# EAGLE design MAPS_nano (EAGLE 7.2.0)
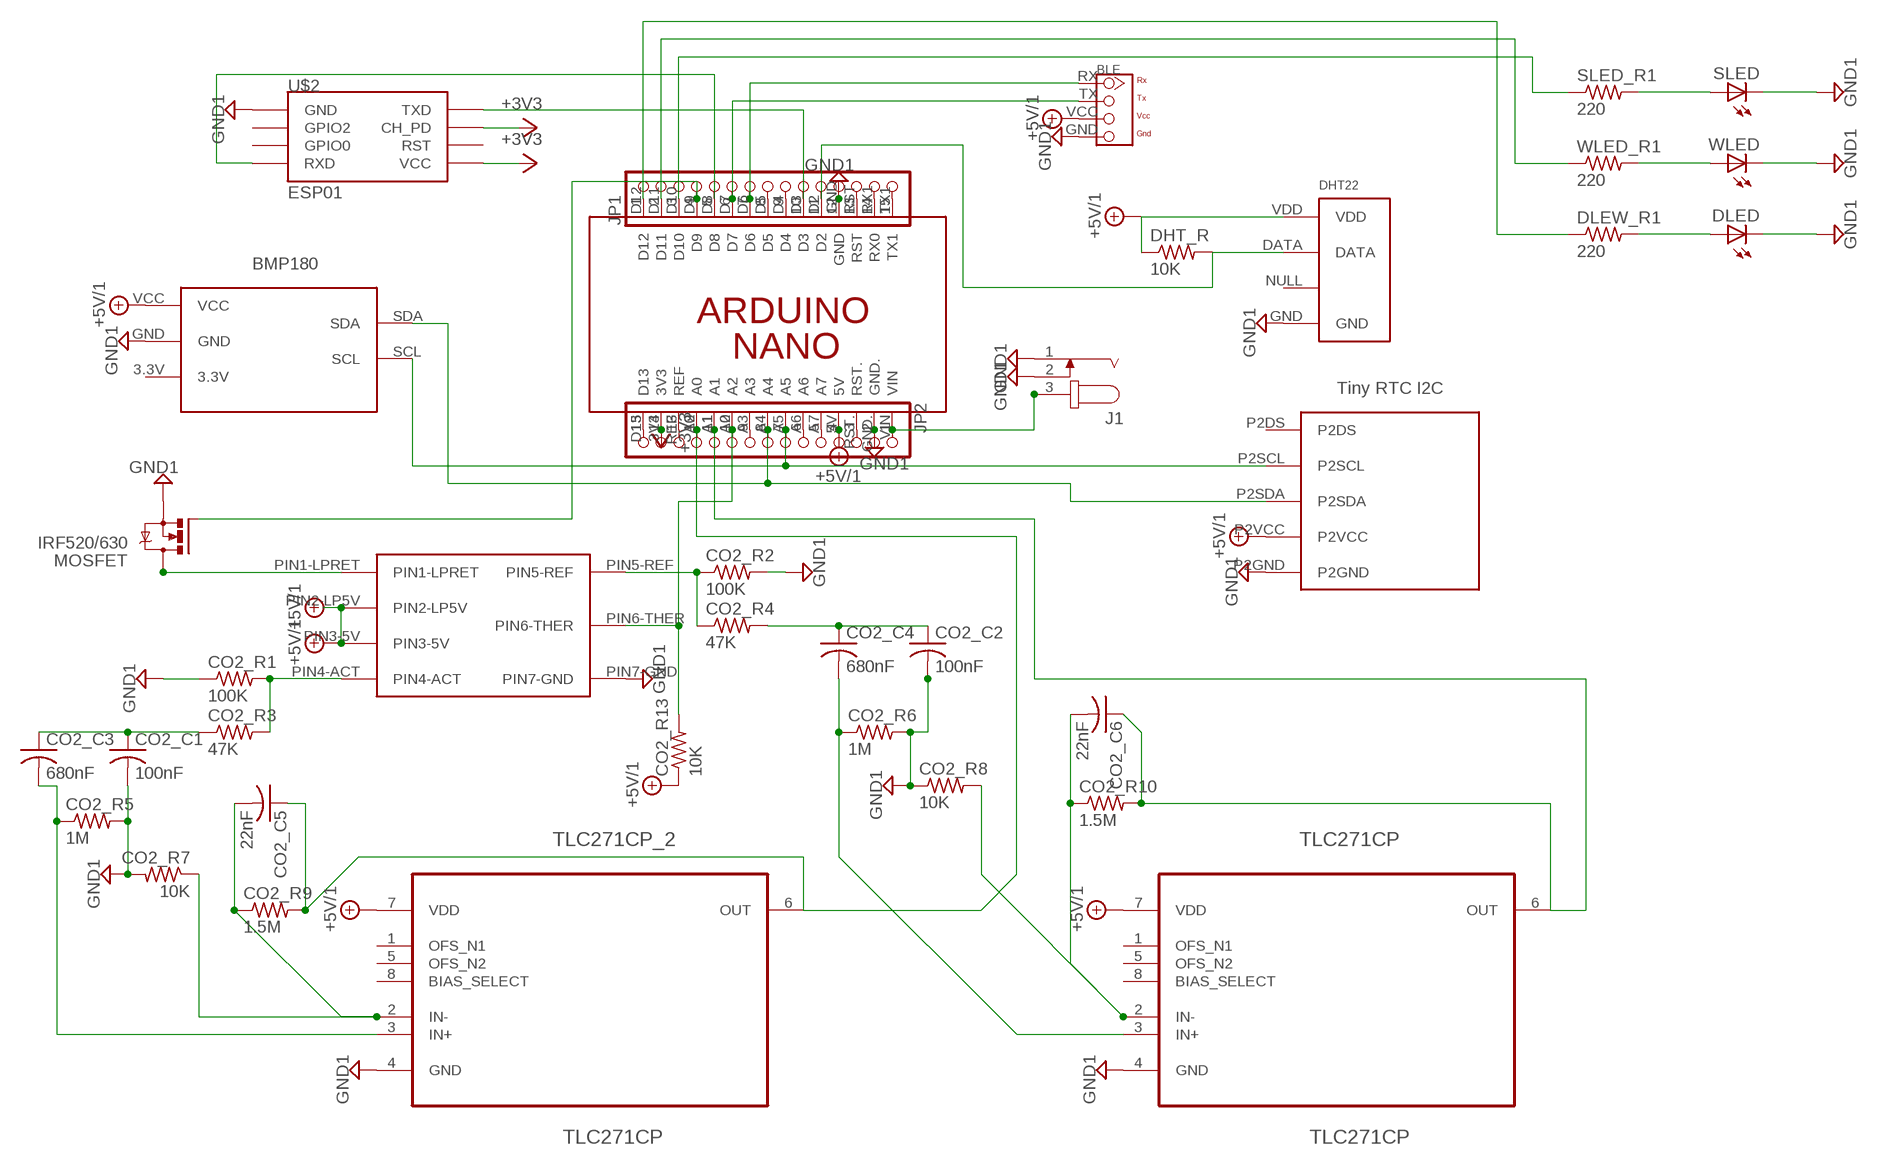
[diagram p0: schematic, sheet 1]

## Parts
BMP180  BMP180  [BMP180]
CO2_C1  100nF  C-USC0805  [C0805]
CO2_C2  100nF  C-USC0805  [C0805]
CO2_C3  680nF  C-USC0805  [C0805]
CO2_C4  680nF  C-USC0805  [C0805]
CO2_C5  22nF  C-USC0805  [C0805]
CO2_C6  22nF  C-USC0805  [C0805]
CO2_R1  100K  R-US_R0805  [R0805]
CO2_R2  100K  R-US_R0805  [R0805]
CO2_R3  47K  R-US_R0805  [R0805]
CO2_R4  47K  R-US_R0805  [R0805]
CO2_R5  1M  R-US_R0805  [R0805]
CO2_R6  1M  R-US_R0805  [R0805]
CO2_R7  10K  R-US_R0805  [R0805]
CO2_R8  10K  R-US_R0805  [R0805]
CO2_R9  1.5M  R-US_R0805  [R0805]
CO2_R10  1.5M  R-US_R0805  [R0805]
CO2_R13  10K  R-US_R0805  [R0805]
DHT_R  10K  R-US_R0805  [R0805]
DLED  LED5MM  [LED5MM]
DLEW_R1  220  R-US_R0805  [R0805]
J1  JACK-PLUG0  [SPC4077]
J2  TWIG-4P-2.0-2.0  [4P-2.0]
JP1  PINHD-1X15-CB  [1X15-CB]
JP2  PINHD-1X15-CB  [1X15-CB]
MOSFET  IRF520/630  IRFZ48Z  [TO220BH]
PCB1  ARDUINO_NANO  [ARDUINO_NANO]
SLED  LED5MM  [LED5MM]
SLED_R1  220  R-US_R0805  [R0805]
TLC271CP  TLC271CP  [DIP254P762X508-8]
TLC271CP_2  TLC271CP  [DIP254P762X508-8]
U1  RHT03_DHT-22_AM2302RA  [RHT03_DHT-22/RA]
U$1  IRC-A1  [ALPHASENSE]
U$2  ESP01  [ESP01]
U$3  RTC_TINY_IIC  [RTC_TINY_IIC]
WLED  LED5MM  [LED5MM]
WLED_R1  220  R-US_R0805  [R0805]

## Nets
+3V3: JP2.14 PCB1.3V3 U$2.CH_PD U$2.VCC
+5V/1: BMP180.VCC CO2_R13.1 DHT_R.1 J2.VCC JP2.4 PCB1.5V TLC271CP.7(VDD) TLC271CP_2.7(VDD) U1.VDD U$1.PIN2-LP5V U$1.PIN3-5V U$3.P2VCC
GND1: BMP180.GND CO2_C1.2 CO2_C2.2 CO2_R1.1 CO2_R2.2 CO2_R5.2 CO2_R6.2 CO2_R7.2 CO2_R8.1 DLED.K(C) J1.1 J1.2 J2.GND JP1.12 JP2.2 MOSFET.S PCB1.GND PCB1.GND. SLED.K(C) TLC271CP.4(GND) TLC271CP_2.4(GND) U1.GND U$1.PIN7-GND U$2.GND U$3.P2GND WLED.K(C)
N$1: DHT_R.2 JP1.11 PCB1.D2 U1.DATA
N$2: J1.3 JP2.1 PCB1.VIN
N$3: JP1.4 MOSFET.G PCB1.D9
N$4: MOSFET.D U$1.PIN1-LPRET
N$5: CO2_R13.2 JP2.10 PCB1.A2 U$1.PIN6-THER
N$6: BMP180.SDA JP2.8 PCB1.A4 U$3.P2SDA
N$7: BMP180.SCL JP2.7 PCB1.A5 U$3.P2SCL
N$8: CO2_C1.1 CO2_C3.1 CO2_R3.1
N$9: CO2_R1.2 CO2_R3.2 U$1.PIN4-ACT
N$10: CO2_C3.2 CO2_R5.1 TLC271CP_2.3(IN+)
N$11: CO2_C5.2 CO2_R7.1 CO2_R9.1 TLC271CP_2.2(IN-)
N$12: CO2_C5.1 CO2_R9.2 JP2.12 PCB1.A0 TLC271CP_2.6(OUT)
N$13: DLEW_R1.1 JP1.1 PCB1.D12
N$14: CO2_R2.1 CO2_R4.1 U$1.PIN5-REF
N$15: CO2_C2.1 CO2_C4.1 CO2_R4.2
N$16: CO2_C4.2 CO2_R6.1 TLC271CP.3(IN+)
N$17: JP1.2 PCB1.D11 WLED_R1.1
N$18: JP1.3 PCB1.D10 SLED_R1.1
N$19: CO2_C6.2 CO2_R8.2 CO2_R10.1 TLC271CP.2(IN-)
N$20: SLED.A SLED_R1.2
N$21: JP1.5 PCB1.D8 U$2.RX(RXD)
N$22: J2.RX JP1.7 PCB1.D6
N$23: J2.TX JP1.6 PCB1.D7
N$24: CO2_C6.1 CO2_R10.2 JP2.11 PCB1.A1 TLC271CP.6(OUT)
N$25: JP1.8 PCB1.D5
N$26: JP1.9 PCB1.D4
N$27: JP1.10 PCB1.D3 U$2.TX(TXD)
N$28: JP1.13 PCB1.RST
N$29: JP1.14 PCB1.RX1(RX0)
N$30: JP1.15 PCB1.TX1
N$31: JP2.3 PCB1.RST.
N$32: JP2.5 PCB1.A7
N$33: JP2.6 PCB1.A6
N$34: JP2.9 PCB1.A3
N$35: JP2.13 PCB1.REF
N$36: JP2.15 PCB1.D13
N$37: WLED.A WLED_R1.2
N$38: DLED.A DLEW_R1.2
Unconnected: BMP180.3.3V TLC271CP.1(OFS_N1) TLC271CP.5(OFS_N2) TLC271CP.8(BIAS_SELECT) TLC271CP_2.1(OFS_N1) TLC271CP_2.5(OFS_N2) TLC271CP_2.8(BIAS_SELECT) U1.NULL U$2.GPIO0 U$2.GPIO2 U$2.RST U$3.P2DS

## Library data of the parts
BMP180 = bmp180:BMP180
CO2_C1-CO2_C6 = resistor:C-US: CAPACITOR, American symbol
CO2_R1-CO2_R10 CO2_R13 DHT_R DLEW_R1 SLED_R1 WLED_R1 = resistor:R-US_: RESISTOR, American symbol
DLED SLED WLED = adafruit:LED: LED OSRAM: - CHIPLED LG R971, LG N971, LY N971, LG Q971, LY Q971, LO R971, LY R971 LH N974, LH R974 LS Q976, LO Q976, LY Q976 LO Q996 - Hyper CHIPLED LW Q18S LB Q993, LB Q99A, LB R99A - SideLED LS A670, LO A670, LY A670, LG A670, LP A670 LB A673, LV A673, LT A673, LW A673 LH A674 LY A675 LS A676, LA A676, LO A676, LY A676, LW A676 LS A679, LY A679, LG A679 - Hyper Micro SIDELED® LS Y876, LA Y876, LO Y876, LY Y876 LT Y87S - SmartLED LW L88C, LW L88S LB L89C, LB L89S, LG L890 LS L89K, LO L89K, LY L89K LS L896, LA L896, LO L896, LY L896 - TOPLED LS T670, LO T670, LY T670, LG T670, LP T670 LSG T670, LSP T670, LSY T670, LOP T670, LYG T670 LG T671, LOG T671, LSG T671 LB T673, LV T673, LT T673, LW T673 LH T674 LS T676, LA T676, LO T676, LY T676, LB T676, LH T676, LSB T676, LW T676 LB T67C, LV T67C, LT T67C, LS T67K, LO T67K, LY T67K, LW E67C LS E67B, LA E67B, LO E67B, LY E67B, LB E67C, LV E67C, LT E67C LW T67C LS T679, LY T679, LG T679 LS T770, LO T770, LY T770, LG T770, LP T770 LB T773, LV T773, LT T773, LW T773 LH T774 LS E675, LA E675, LY E675, LS T675 LS T776, LA T776, LO T776, LY T776, LB T776 LHGB T686 LT T68C, LB T68C - Hyper Mini TOPLED® LB M676 - Mini TOPLED Santana® LG M470 LS M47K, LO M47K, LY M47K Source: http://www.osram.convergy.de/
J1 = con-jack:JACK-PLUG: DC POWER JACK Power Jack, DC, Right Angle, Through Hole, Rated 5A at 16VDC, PC Terminals Distributor: Farnell (www.Farnell.de) Drawing: 84N1161.pdf / 84N1162.pdf Manufacturer: SPC Technology (www.spctechnology.com) Type: SPC4077 / SPC 4078; OC_FARNELL: unknown; OC_NEWARK: unknown
J2 = Connector:TWIG-4P-2.0
JP1 JP2 = adafruit:PINHD-1X15: PIN HEADER
MOSFET = mytransistor-power:IRFZ48: N Channel HEXFET® Power MOSFET Logic Level Source: http://www.irf.com/product-info/datasheets/data/irfz48z.pdf
PCB1 = uno_pin:ARDUINO_NANO: Device for representing an Arduino Nano board with a footprint in an EAGLE design. Created by Dave Young for Element14. More EAGLE documentation at: http://www.element14.com/community/community/knode/cadsoft_eagle
TLC271CP TLC271CP_2 = tlc271cp:TLC271CP: OPERATIONAL AMPLIFIER; MPN: TLC271CP; OC_FARNELL: 1103011; OC_NEWARK: 35K1199; PACKAGE: PDIP-8; SUPPLIER: Texas Instruments
U1 = RHT03_DHT-22_AM2302:RHT03_DHT-22_AM2302: RHT03 / DHT-22 / AM2302 Packages and symbol for the RHT03 / DHT-22 relative humidity and temperature sensor. Note: The AM2302 is a wired version of the DHT-22 which typically requires less clearance and is thus provided as a separate package.; PROD_ID: SEN-10167
U$1 = iRC-A1:IRC-A1: Alpha sense IRC-A1 infrared CO2 sensor
U$2 = esp8266modules:ESP01: ESP8266 Wifi module 01
U$3 = RTC_TINY_IIC:RTC_TINY_IIC

## Board
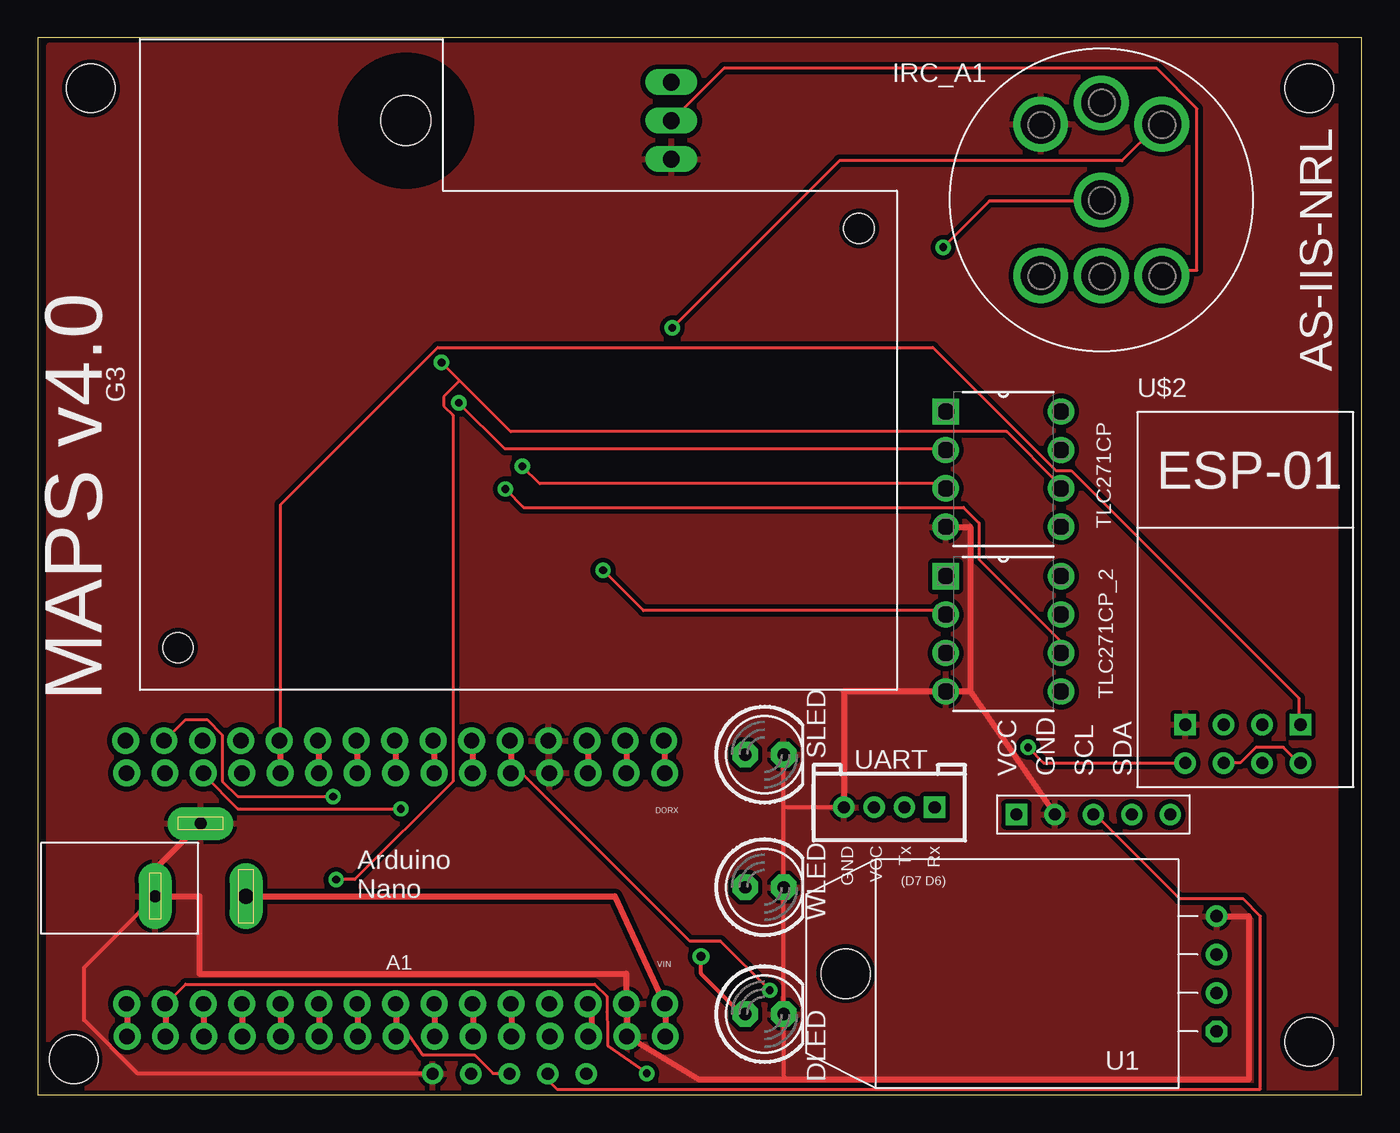
[diagram p1: board, top side]
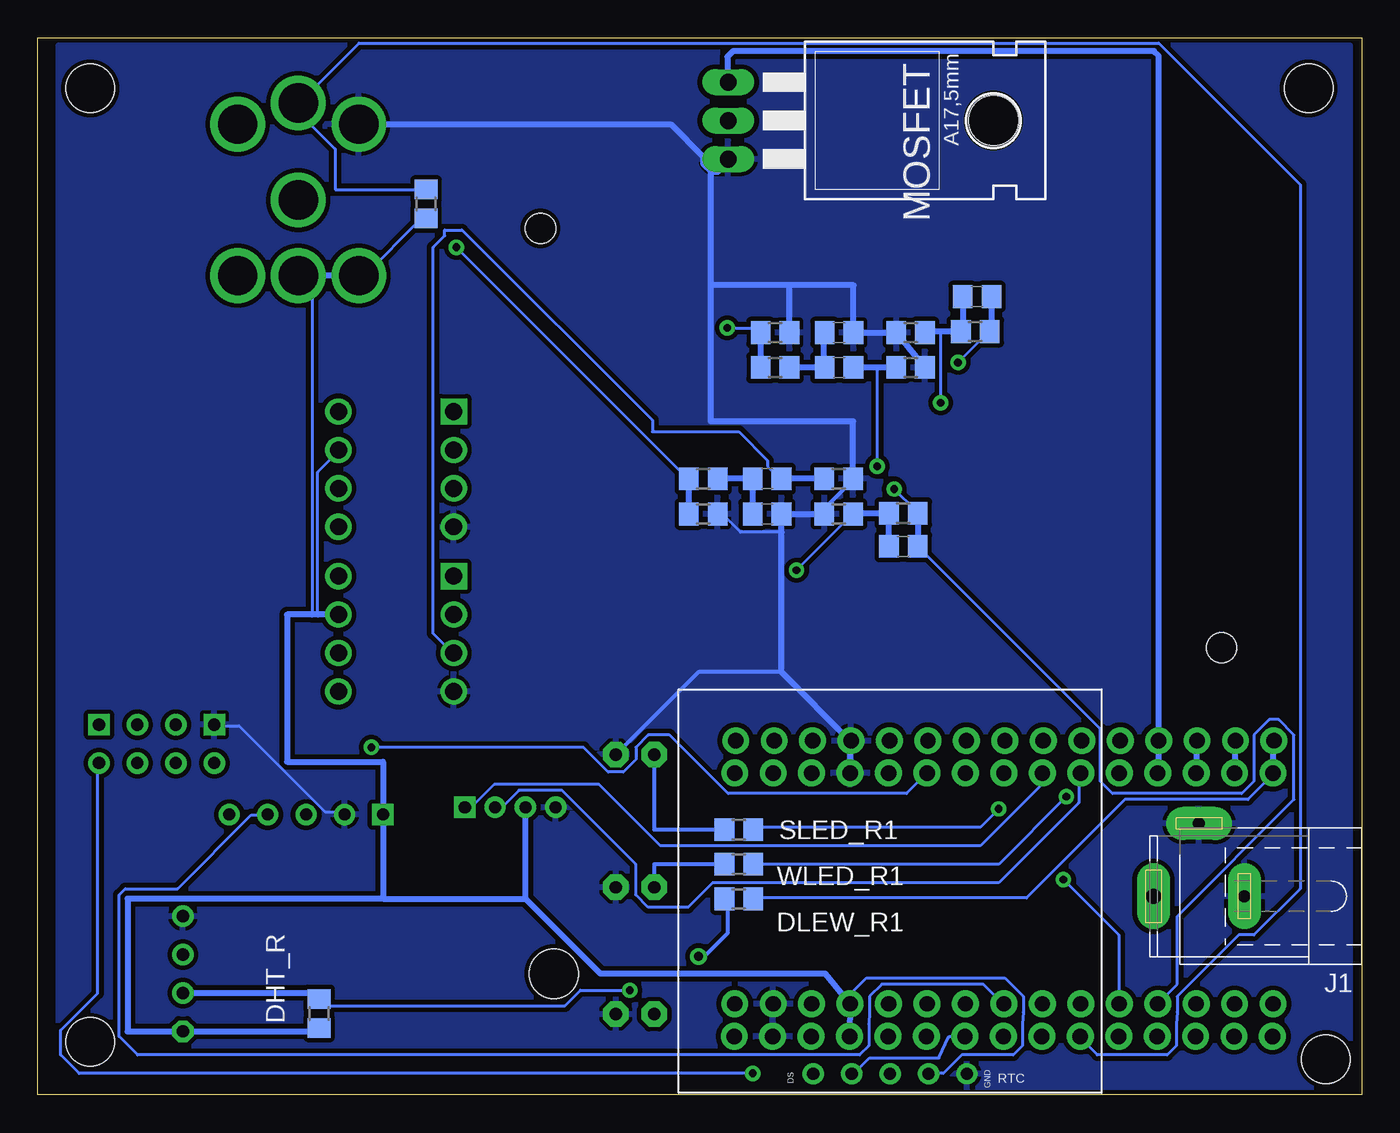
[diagram p2: board, bottom side, seen from below]

Size 87.46 x 69.84 mm. Coordinates in mm from the lower left corner, seen from the top.
Outline: 0,0 87.46,0 87.46,69.84 0,69.84 0,0
Copper layers (1*16): Top 0.035mm / dielectric 1.5mm / Bottom 0.035mm
Design rules "SparkFun": minimum track width 8mil, minimum drill 20mil, track to track 8mil, track to pad 8mil, pad to pad 8mil, via to via 8mil, smd to smd 8mil, copper to edge 8mil, drill to drill 8mil, minimum pad ring 12mil, minimum via ring 10mil, stop-mask expansion 4mil, vias tented up to drill 20mil, thermal gap 10mil
Holes 3.2 mm at 3.5,66.5 84,66.5 2.36,2.36 84,3.5

### Footprints (pad centres in the part's own frame; a part is rotated, then mirrored left to right if it is on the bottom)
BMP180 = drill 0.8: 3.3V -3.81,1.27; GND -11.43,1.27; SCL -8.89,1.27; SDA -6.35,1.27 | drill 0.8 square: VCC -13.97,1.27
C0805 = smd 1.3 x 1.5: 1 -0.95,0; 2 0.95,0
R0805 = smd 1.3 x 1.5: 1 -0.95,0; 2 0.95,0
LED5MM = drill 0.813 pad 1.676 octagon: A -1.27,0; K 1.27,0
SPC4077 = drill 0.8 pad 2.184 long: 1 -3,0; 2 0,-4.8 | drill 1 pad 2.184 long: 3 3,0
4P-2.0 = drill 0.8 pad 1.27: GND 3,0; TX -1,0; VCC 1,0 | drill 0.8 pad 1.27 square: RX -3,0
1X15-CB = drill 1.016 pad 1.778: 1 -17.78,0; 2 -15.24,0; 3 -12.7,0; 4 -10.16,0; 5 -7.62,0; 6 -5.08,0; 7 -2.54,0; 8 0,0; 9 2.54,0; 10 5.08,0; 11 7.62,0; 12 10.16,0; 13 12.7,0; 14 15.24,0; 15 17.78,0
TO220BH = drill 1.118 long: D 0,-6.35; G -2.54,-6.35; S 2.54,-6.35 | hole 3.302: 0,11.176
ARDUINO_NANO = drill 1.016 pad 1.778: 3V3 6.35,1.27; 5V 31.75,1.27; A0 11.43,1.27; A1 13.97,1.27; A2 16.51,1.27; A3 19.05,1.27; A4 21.59,1.27; A5 24.13,1.27; A6 26.67,1.27; A7 29.21,1.27; D2 29.21,16.51; D3 26.67,16.51; D4 24.13,16.51; D5 21.59,16.51; D6 19.05,16.51; D7 16.51,16.51; D8 13.97,16.51; D9 11.43,16.51; D10 8.89,16.51; D11 6.35,16.51; D12 3.81,16.51; D13 3.81,1.27; GND 31.75,16.51; GND. 36.83,1.27; REF 8.89,1.27; RST 34.29,16.51; RST. 34.29,1.27; RX1 36.83,16.51; TX1 39.37,16.51; VIN 39.37,1.27
DIP254P762X508-8 = drill 1.118 square: 1 -7.62,7.62 | drill 1.118: 2 -7.62,5.08; 3 -7.62,2.54; 4 -7.62,0; 5 0,0; 6 0,2.54; 7 0,5.08; 8 0,7.62
RHT03_DHT-22/RA = drill 0.8: DATA -1.27,0; GND 3.81,0; NULL 1.27,0 | drill 0.8 octagon: VDD -3.81,0 | hole 3.25: 0,24.5
ALPHASENSE = drill 2.6: PIN1-LPRET 14,5; PIN2-LP5V 10,5; PIN3-5V 6,5; PIN4-ACT 10,10; PIN5-REF 14,15; PIN6-THER 10,16.4; PIN7-GND 6,15
ESP01 = drill 0.8: CH_PD -1.285,-8.178; GPIO0 1.255,-5.638; GPIO2 -1.285,-5.638; RST 1.255,-8.178; TX -3.825,-8.178; VCC 3.795,-8.178 | drill 0.8 square: GND -3.825,-5.638; RX 3.795,-5.638
RTC_TINY_IIC = drill 0.8: P2DS 1.27,-8.89; P2GND 1.27,-19.05; P2SCL 1.27,-11.43; P2SDA 1.27,-13.97; P2VCC 1.27,-16.51
G3 = hole 2: 30.5,-47.5; 2.8,-2.5

### Placement (x,y rotation side)
BMP180  78.62,17.25 0 top
CO2_C1  39.27,38.38 0 bottom
CO2_C2  34.52,50.37 0 bottom
CO2_C3  39.27,40.71 0 bottom
CO2_C4  34.52,48.06 0 bottom
CO2_C5  30.28,36.24 180 bottom
CO2_C6  25.41,52.74 180 bottom
CO2_R1  43.5,38.38 180 bottom
CO2_R2  38.75,50.37 0 bottom
CO2_R3  43.5,40.71 180 bottom
CO2_R4  38.75,48.06 0 bottom
CO2_R5  34.55,40.71 0 bottom
CO2_R6  29.8,48.06 0 bottom
CO2_R7  34.55,38.38 180 bottom
CO2_R8  29.8,50.37 0 bottom
CO2_R9  30.28,38.42 0 bottom
CO2_R10  25.53,50.43 0 bottom
CO2_R13  61.8,58.87 90 bottom
DHT_R  68.88,5.38 90 bottom
DLED  48.01,5.33 0 top
DLEW_R1  41.15,12.95 180 bottom
J1  10.75,13.12 180 bottom
J2  56.25,19 180 top
JP1  23.57,23.4 0 top
JP2  23.67,3.87 180 top
MOSFET  35.5,64.38 270 bottom
PCB1  2.05,4.75 0 top
SLED  48.01,22.48 0 top
SLED_R1  41.15,17.53 180 bottom
TLC271CP  67.6,37.53 0 top
TLC271CP_2  67.6,26.65 0 top
U1  77.88,8 90 top
U$1  60.26,49.13 0 top
U$2  79.63,30.1 0 top
U$3  45.12,0.12 90 bottom
U$4  [G3]  6.75,26.75 90 top
WLED  48.01,13.72 0 top
WLED_R1  41.15,15.24 180 bottom

### Tracks (layer width: path | path; a pad name or v marks a point on that pad's centre or on a via)
+3V3  (via drill 0.51)
  Top 0.203: U$2.CH_PD 78.44,21.95 79.45,21.95 80.47,22.96 82.3,22.96 83.31,21.95 U$2.VCC | v40.23,1.42 37.64,3.25 37.64,4.29 37.59,5.49 37.59,6.5 36.78,7.32 9.75,7.32 8.53,6.1 PCB1.3V3
  Top 0.406: PCB1.3V3 8.43,6.02 JP2.14
  Bottom 0.203: v40.23,1.42 84.73,1.42 85.95,2.64 85.95,4.27 83.52,6.71 83.52,21.74 U$2.VCC
+5V/1
  Bottom 0.203: CO2_R13.1 62.1,57.91 65.91,54.1 U$1.PIN3-5V | TLC271CP.7 67.82,42.29 68.96,41.15 68.96,31.73 68.96,31.62 | 69.34,31.62 69.34,31.73 69.34,54.1 U$1.PIN2-LP5V | U$3.P2VCC 28.45,1.42 27.64,1.42 26.42,2.64 23.01,2.64 22.4,3.25 22.4,4.67 22.35,5.49 22.35,6.5 23.57,7.72 32.72,7.72 33.93,6.5 PCB1.5V
  Bottom 0.406: U$1.PIN3-5V U$1.PIN2-LP5V | DHT_R.1 68.88,4.19 U1.VDD 81.53,4.19 81.53,12.95 64.66,12.95 | TLC271CP_2.7 68.96,31.73 69.34,31.73 71,31.73 71,22 64.66,22 BMP180.VCC 64.66,12.95 | JP2.4 PCB1.5V 35.43,8 50.29,8 55.24,12.95 | 55.24,12.95 J2.VCC | 64.66,12.95 55.24,12.95
GND1
  Top 0.254: U$3.P2GND 6.61,1.4 3.05,4.95 3.05,8.42 J1.1 | 49.53,1 49.28,1.25 DLED.K WLED.K 49.28,19.05 | 49.28,19.05 SLED.K | J2.GND 49.33,19 49.28,19.05
  Top 0.406: J1.2 7.75,14.93 J1.1 10.67,13.12 10.67,8 38.86,8 38.86,6.02 PCB1.GND. 38.91,6.02 JP2.2 43.68,1 49.53,1 80,1 80,11.81 U1.GND | TLC271CP.4 61.59,37.53 61.59,26.67 | 61.59,26.67 59.98,26.67 | 59.98,26.67 TLC271CP_2.4 | 59.98,26.67 53.25,26.67 J2.GND | 61.59,26.67 BMP180.GND
  Bottom 0.203: MOSFET.S 41.91,61.72 42.67,60.96 42.67,61 | 38.33,37.19 41.05,37.19 42.06,38.2 42.47,38.2 CO2_R1.1 | BMP180.GND 67.26,18.69 68.48,18.69 74.17,24.38 75.79,24.38 U$2.GND
  Bottom 0.254: CO2_R7.2 35.5,38.75 34.25,40 34.25,40.06 CO2_R5.2 | 38.33,27.93 43.83,27.93 SLED.K
  Bottom 0.406: CO2_R7.2 CO2_C1.2 38.33,37.19 38.33,27.93 33.8,23.4 | 33.6,40.28 CO2_R5.2 33.6,44.5 43,44.5 43,53.5 | 43,53.5 43,61 | 43,61 42.67,61 42.5,61 | CO2_R2.2 37.8,53.5 | 37.8,53.5 43,53.5 | U$1.PIN7-GND 45.63,64.13 43.5,62 43.5,61.5 43,61 | 37.8,53.5 33.58,53.5 CO2_C2.2 CO2_R8.1 CO2_R6.2 | 33.8,23.4 PCB1.GND | JP1.12 33.8,23.4
  pour Bottom (isolate 0.305): 0.76,69.34 86.11,69.34 86.11,0.38 0.76,0.38
  pour Top (isolate 0.305): 0.76,69.34 85.72,69.34 85.72,0.38 0.76,0.38
N$1  (via drill 0.51)
  Top 0.203: v48.36,6.91 45.11,10.16 43.08,10.16 32.11,21.13 31.29,21.13 PCB1.D2
  Top 0.406: JP1.11 31.26,23.4 PCB1.D2
  Bottom 0.203: v48.36,6.91 51.61,6.91 52.63,5.89 68.28,5.89 68.68,6.3 DHT_R.2
  Bottom 0.406: U1.DATA 68.88,6.73 DHT_R.2
N$2
  Top 0.406: J1.3 38.12,13.12 PCB1.VIN 41.45,6.02 JP2.1
N$3
  Bottom 0.406: PCB1.D9 13.41,21.26 JP1.4 13.41,68.66 13.72,68.96 41.53,68.96 41.91,68.58 41.91,66.97 MOSFET.G
N$4
  Top 0.203: MOSFET.D 41.91,64.39 45.34,67.82 73.91,67.82 76.58,65.15 76.58,54.48 74.3,54.48 U$1.PIN1-LPRET
N$5
  Top 0.406: PCB1.A2 18.59,6.02 JP2.10
  Bottom 0.203: CO2_R13.2 62.1,59.82 67.82,59.82 67.82,62.48 70.1,64.77 70.1,65.15 U$1.PIN6-THER 70.1,65.63 66.24,69.49 13.41,69.49 4.06,60.15 4.06,13.61 7.11,10.57 8.13,10.57 12.19,6.5 12.19,5.49 12.24,4.67 12.24,3.25 12.85,2.64 17.48,2.64 18.69,3.86 19.3,3.86 JP2.10
N$6
  Top 0.203: U$3.P2SDA 31.09,1.42 30.07,1.42 28.85,2.64 25.43,2.64 24.59,3.86 JP2.8
  Top 0.406: PCB1.A4 23.67,6.02 JP2.8
  Bottom 0.203: BMP180.SDA 72.34,18.49 73.36,18.49 78.23,13.61 81.69,13.61 82.09,13.21 82.09,3.86 80.87,2.64 33.17,2.64 32.56,3.25 32.56,4.67 32.51,5.49 32.51,6.5 31.7,7.32 24.99,7.32 23.77,6.1 PCB1.A4
N$7
  Top 0.203: BMP180.SCL 70.1,18.29 75.44,12.95 79.63,12.95 80.77,11.81 80.77,0.38 34.29,0.38 33.53,1.14 U$3.P2SCL
  Top 0.406: PCB1.A5 26.21,6.02 JP2.7
  Bottom 0.203: JP2.7 27.03,3.86 27.25,3.86 27.91,2.44 32.51,2.44 33.53,1.42 U$3.P2SCL
N$8
  Bottom 0.406: CO2_C1.1 CO2_C3.1 CO2_R3.1
N$9  (via drill 0.51)
  Top 0.203: v59.82,56.01 62.87,59.05 70.1,59.05 U$1.PIN4-ACT
  Bottom 0.203: v59.82,56.01 44.58,40.77 CO2_R3.2
  Bottom 0.406: CO2_R1.2 CO2_R3.2
N$10
  Bottom 0.203: CO2_C3.2 38.48,40.77 39.24,41.53 39.24,41.91 41.15,43.81 46.86,43.81 46.86,44.58 59.44,57.15 60.58,57.15 60.58,56.77 61.34,56.01 61.34,30.48 60.2,29.34 TLC271CP_2.3
  Bottom 0.406: CO2_R5.1 CO2_C3.2
N$11  (via drill 0.51)
  Top 0.203: v37.34,34.67 40.01,32 59.82,32 TLC271CP_2.2
  Bottom 0.203: v37.34,34.67 33.91,38.1 CO2_R7.1
  Bottom 0.406: CO2_C5.2 31,36.01 31,36 31.5,36 31.5,36.5 31,36.5 31.23,36.73 CO2_R9.1 33.55,38.42 CO2_R7.1
N$12  (via drill 0.51)
  Top 0.203: v30.89,40.03 32.11,38.81 61.16,38.81 62.18,37.8 62.18,35.36 67.46,30.07 67.46,29.26 TLC271CP_2.6
  Top 0.406: PCB1.A0 13.51,6.02 JP2.12
  Bottom 0.203: CO2_C5.1 29.26,36.17 17.27,24.18 17.27,20.73 16.46,19.91 7.92,19.91 7.11,20.73 7.11,23.77 6.1,24.79 5.49,24.79 4.47,23.77 4.47,19.51 12.19,11.79 12.19,7.32 13.41,6.1 PCB1.A0 | v30.89,40.03 29.46,38.61 CO2_R9.2
  Bottom 0.406: CO2_R9.2 CO2_C5.1
N$13
  Bottom 0.203: DLEW_R1.1 40.03,13.01 22.15,13.01 15.65,19.51 7.52,19.51 5.89,21.13 PCB1.D12
  Bottom 0.406: JP1.1 5.86,23.4 PCB1.D12
N$14  (via drill 0.51)
  Top 0.203: v41.91,50.67 52.96,61.72 71.63,61.72 73.91,64.01 U$1.PIN5-REF
  Bottom 0.203: v41.91,50.67 40.01,50.67 CO2_R2.1
  Bottom 0.406: CO2_R4.1 CO2_R2.1
N$15
  Bottom 0.406: CO2_C2.1 35.48,50.25 35.56,50.16 35.56,48.15 CO2_C4.1 CO2_R4.2
N$16  (via drill 0.51)
  Top 0.203: v32,41.53 33.15,40.39 59.82,40.39 TLC271CP.3
  Bottom 0.203: v32,41.53 32,48.06
  Bottom 0.406: CO2_R6.1 32,48.06 CO2_C4.2
N$17  (via drill 0.51)
  Top 0.203: v19.51,19.71 13.21,19.71 12.19,20.73 12.19,23.77 11.18,24.79 9.75,24.79 8.53,23.57 JP1.2
  Bottom 0.203: WLED_R1.1 23.98,15.24 v19.51,19.71
  Bottom 0.406: JP1.2 8.4,23.4 PCB1.D11
N$18  (via drill 0.51)
  Top 0.203: v23.98,18.9 13.21,18.9 10.97,21.13 PCB1.D10
  Bottom 0.203: v23.98,18.9 25.2,17.68 40.03,17.68 SLED_R1.1
  Bottom 0.406: JP1.3 10.94,23.4 PCB1.D10
N$19  (via drill 0.51)
  Top 0.203: v27.81,45.72 30.86,42.67 59.82,42.67 TLC271CP.2
  Bottom 0.203: v27.81,45.72 27.81,50.43
  Bottom 0.406: CO2_C6.2 26.36,50.55 CO2_R10.1 27.81,50.43 28.79,50.43 CO2_R8.2
N$20
  Bottom 0.254: SLED.A 46.74,17.53 SLED_R1.2
N$21
  Top 0.203: U$2.RX 83.31,24.59 83.31,26.21 68.28,41.25 67.26,41.25 59.13,49.38 26.42,49.38 16.05,39.01 16.05,23.57 JP1.5
  Top 0.406: JP1.5 16.02,23.4 PCB1.D8
N$22
  Top 0.406: JP1.7 21.1,23.4 PCB1.D6
  Bottom 0.203: J2.RX 59.13,19.1 58.73,19.1 57.3,20.52 50.39,20.52 46.33,16.46 25.2,16.46 21.13,20.52 21.13,21.13 PCB1.D6
N$23
  Top 0.406: JP1.6 18.56,23.4 PCB1.D7
  Bottom 0.203: J2.TX 57.1,19.1 56.69,19.1 55.68,20.12 52.83,20.12 47.95,15.24 47.95,13.21 47.14,12.39 44.5,12.39 42.88,14.02 23.98,14.02 18.69,19.3 18.69,21.13 PCB1.D7
N$24  (via drill 0.51)
  Top 0.203: 27.88,47.18 31.24,43.81 64.01,43.81 67.44,40.39 TLC271CP.6 | 27.88,47.18 v26.67,48.39 | v19.71,14.22 20.93,14.22 27.43,20.73 27.43,44.91 26.82,45.52 26.82,46.13 27.88,47.18
  Top 0.406: PCB1.A1 16.05,6.02 JP2.11
  Bottom 0.203: v26.67,48.39 24.77,50.29 CO2_R10.2 | v19.71,14.22 16.05,10.57 16.05,6.1 PCB1.A1
  Bottom 0.406: CO2_C6.1 24.45,50.55 CO2_R10.2
N$25
  Top 0.406: JP1.8 23.64,23.4 PCB1.D5
N$26
  Top 0.406: JP1.9 26.18,23.4 PCB1.D4
N$27  (via drill 0.51)
  Top 0.203: v65.43,22.96 66.45,21.95 75.79,21.95 U$2.TX
  Top 0.406: JP1.10 28.72,23.4 PCB1.D3
  Bottom 0.203: v65.43,22.96 51.41,22.96 49.78,21.34 48.77,21.34 47.95,22.15 47.95,22.96 47.14,23.77 45.72,23.77 41.86,19.91 30.07,19.91 28.85,21.13 PCB1.D3
N$28
  Top 0.406: JP1.13 36.34,23.4 PCB1.RST
N$29
  Top 0.406: JP1.14 38.88,23.4 PCB1.RX1
N$30
  Top 0.406: JP1.15 41.42,23.4 PCB1.TX1
N$31
  Top 0.406: PCB1.RST. 36.58,6.02 36.58,3.43 36.37,3.43 JP2.3
N$32
  Top 0.406: PCB1.A7 31.29,6.02 JP2.5
N$33
  Top 0.406: PCB1.A6 28.75,6.02 JP2.6
N$34
  Top 0.406: PCB1.A3 20.95,6.02 20.95,5.71 21.13,5.71 JP2.9
N$35
  Top 0.406: PCB1.REF 10.97,6.02 JP2.13
N$36
  Top 0.406: PCB1.D13 5.89,6.02 JP2.15
N$37
  Bottom 0.254: WLED_R1.2 46.74,15.24 WLED.A
N$38  (via drill 0.6)
  Top 0.254: v43.81,9.14 43.81,8 46.48,5.33 DLED.A
  Bottom 0.254: DLEW_R1.2 41.91,12.95 41.91,10.67 43.81,8.76 v43.81,9.14

### Text on the board
tPlace: AS-IIS-NRL | MAPS v4.0 | A1
tNames: (D7 D6)